# Altium schematic sheet Principal.SchDoc
size A4; SheetNumber: 1
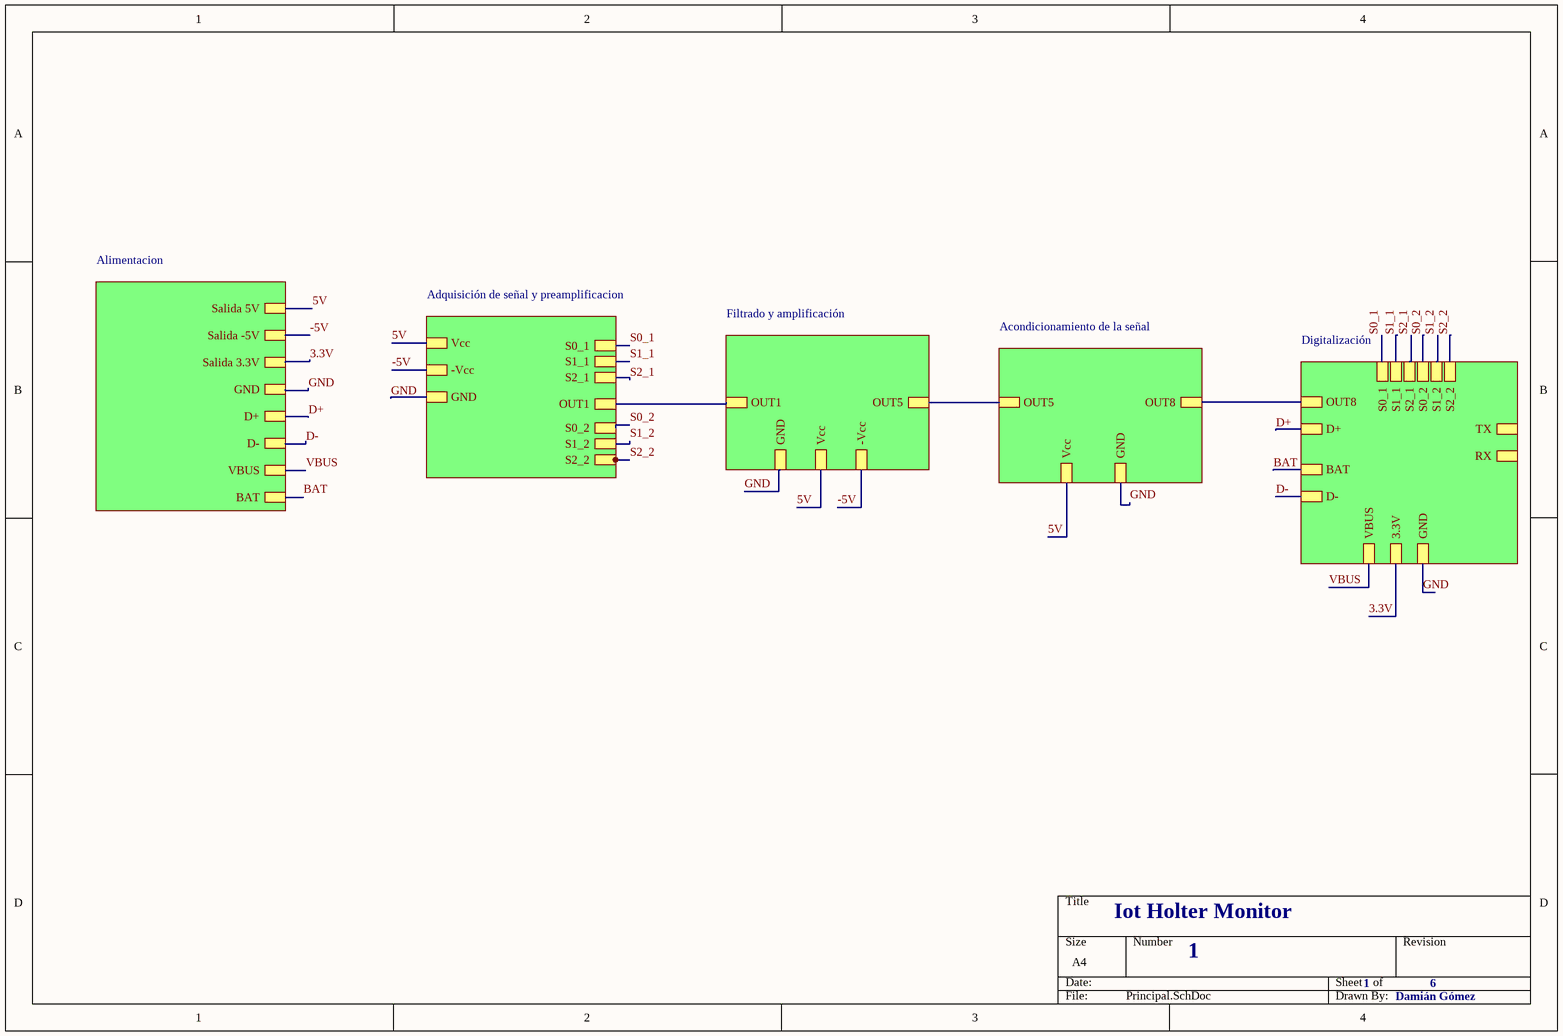
[diagram p0: Principal.SchDoc]

## Sub-sheets
Acondicionamiento de la señal = Acondicionamiento de la señal: OUT8, OUT5, Vcc, GND
Adquisición de señal y preamplificacion = Adquisicion de señal y preamplificacion: -Vcc, Vcc, GND, S2_1, S1_2, S1_1, S0_2, S0_1, S2_2, OUT1
Alimentacion = Alimentacion: Salida 3.3V, Salida -5V, Salida 5V, GND, D-, D+, VBUS, BAT
Digitalización = Digitalización: VBUS, TX, RX, GND, D-, D+, BAT, 3.3V, OUT8, S0_1, S1_1, S1_2, S0_2, S2_1, S2_2
Filtrado y amplificación = Filtrado y amplificación: OUT5, OUT1, GND, Vcc, -Vcc

## Nets
3.3V: sheet Alimentacion/Salida 3.3V, sheet Digitalización/3.3V
5V: sheet Alimentacion/Salida 5V, sheet Adquisición de señal y preamplificacion/Vcc, sheet Filtrado y amplificación/Vcc, sheet Acondicionamiento de la señal/Vcc
-5V: sheet Alimentacion/Salida -5V, sheet Adquisición de señal y preamplificacion/-Vcc, sheet Filtrado y amplificación/-Vcc
BAT: sheet Alimentacion/BAT, sheet Digitalización/BAT
D+: sheet Alimentacion/D+, sheet Digitalización/D+
D-: sheet Alimentacion/D-, sheet Digitalización/D-
GND: sheet Alimentacion/GND, sheet Adquisición de señal y preamplificacion/GND, sheet Filtrado y amplificación/GND, sheet Acondicionamiento de la señal/GND, sheet Digitalización/GND
S0_1: sheet Adquisición de señal y preamplificacion/S0_1, sheet Digitalización/S0_1
S0_2: sheet Adquisición de señal y preamplificacion/S0_2, sheet Digitalización/S0_2
S1_1: sheet Adquisición de señal y preamplificacion/S1_1, sheet Digitalización/S1_1
S1_2: sheet Adquisición de señal y preamplificacion/S1_2, sheet Digitalización/S1_2
S2_1: sheet Adquisición de señal y preamplificacion/S2_1, sheet Digitalización/S2_1
S2_2: sheet Adquisición de señal y preamplificacion/S2_2, sheet Digitalización/S2_2
VBUS: sheet Alimentacion/VBUS, sheet Digitalización/VBUS
(unnamed): sheet Adquisición de señal y preamplificacion/OUT1, sheet Filtrado y amplificación/OUT1
(unnamed): sheet Filtrado y amplificación/OUT5, sheet Acondicionamiento de la señal/OUT5
(unnamed): sheet Acondicionamiento de la señal/OUT8, sheet Digitalización/OUT8

## Notes on the sheet
- Iot Holter Monitor
- 1
- 6
- Damián Gómez